# EAGLE schematic aqm_sch (EAGLE 9.6.2)
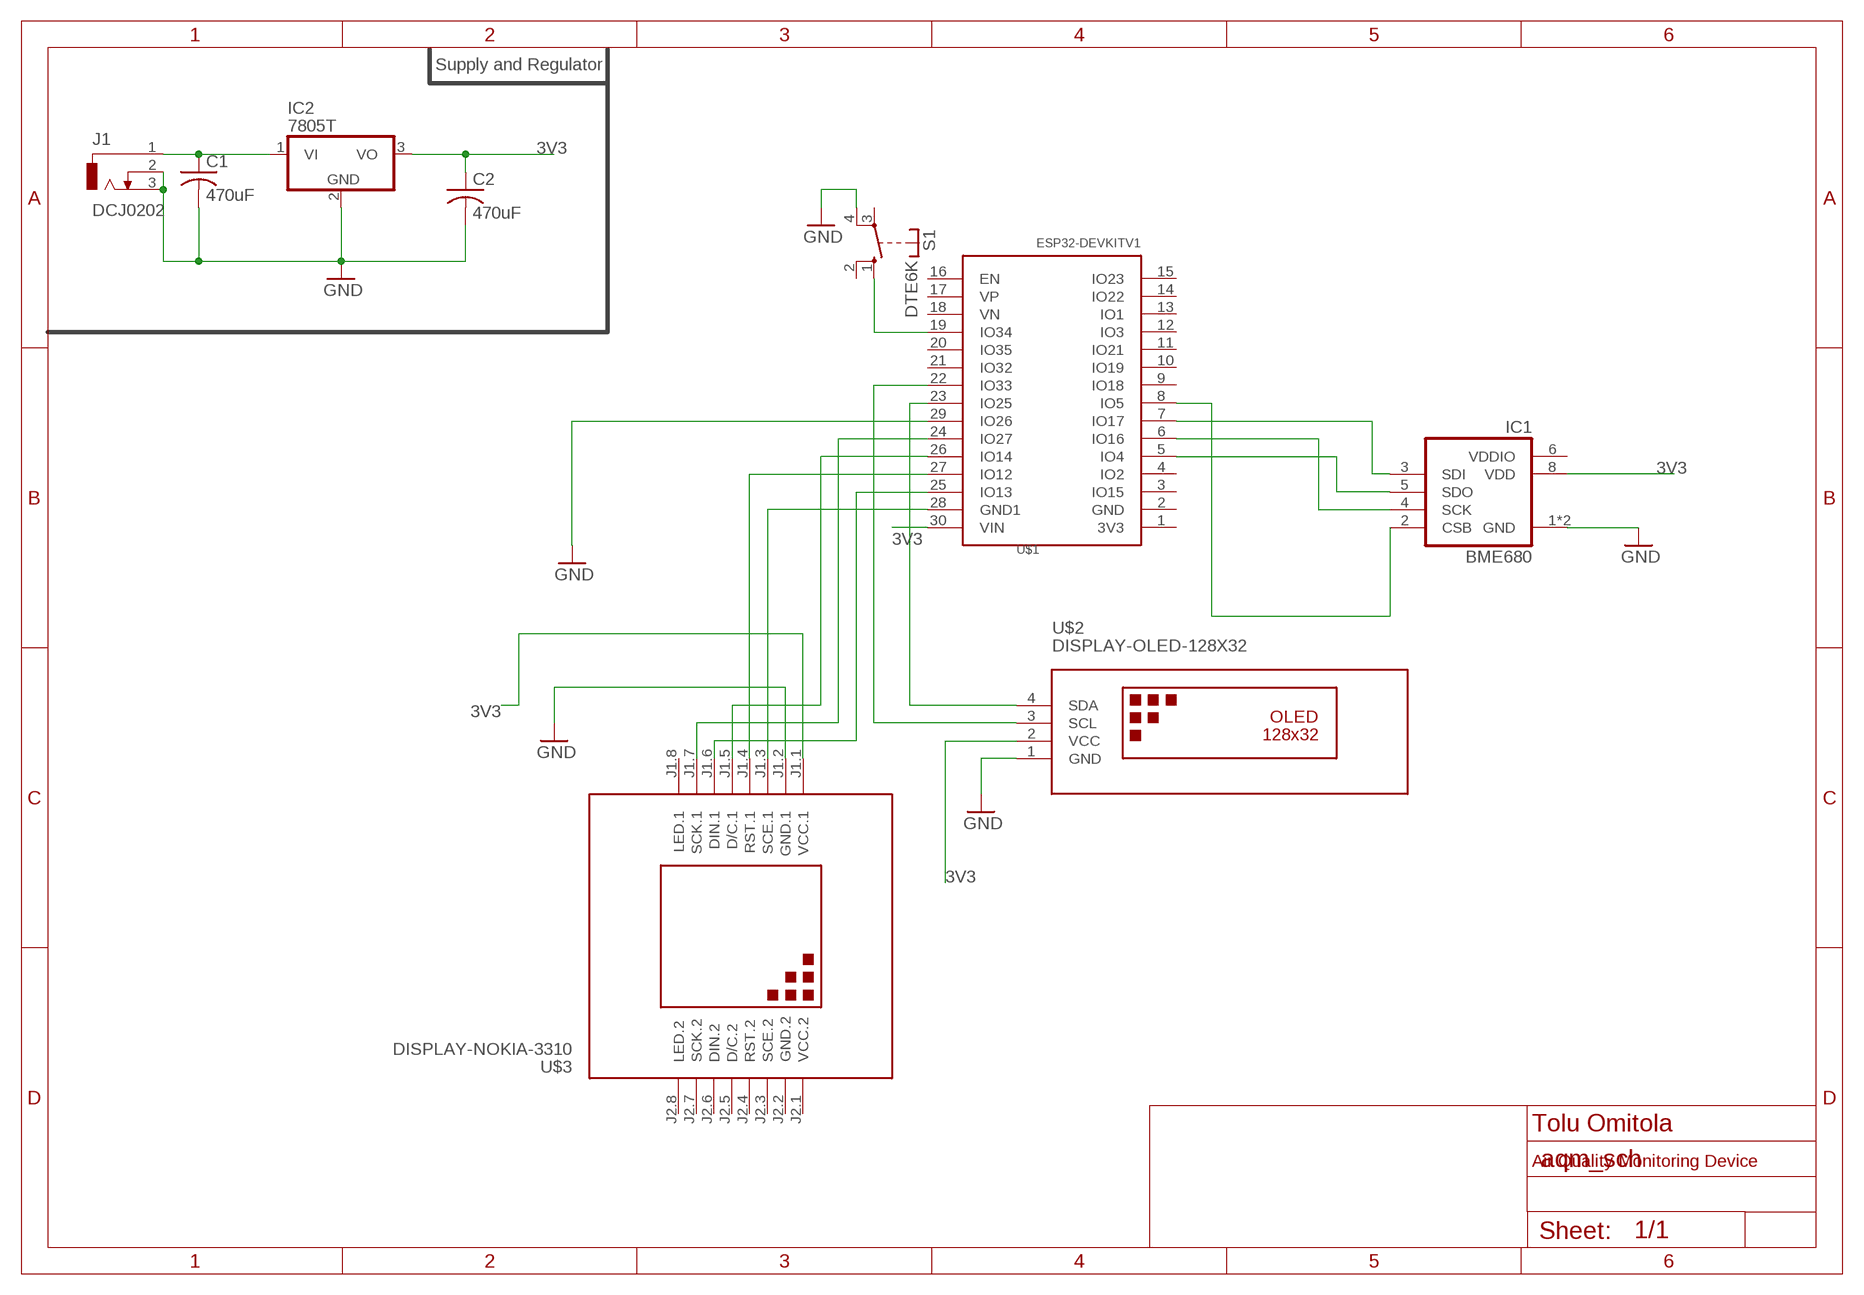
[diagram p0: schematic, sheet 1]

## Parts
C1  470uF  C-US075-052X106  [C075-052X106]
C2  470uF  C-US075-052X106  [C075-052X106]
IC1  BME680  [BME680]
IC2  7805T  [TO220H]
J1  DCJ0202  [DCJ0202]
S1  DTE6K  [DTE6K]
U$1  ESP32DEVKITV1  [ESP32-DEVKITV1]
U$2  DISPLAY-OLED-128X32  [DISPLAY-OLED-128X32]
U$3  DISPLAY-NOKIA-3310  [DISPLAY-NOKIA-3310]

## Nets
3V3: C2.1 IC1.8(VDD) IC2.3(VO) U$1.30(VIN) U$2.2(VCC) U$3.J1.1(VCC.1)
GND: C1.2 C2.2 IC1.1(GND) IC1.7(GND) IC2.2(GND) J1.2 J1.3 S1.4(P) U$1.29(IO26) U$2.1(GND) U$3.J1.2(GND.1)
N$1: U$1.26(IO14) U$3.J1.5(D/C.1)
N$2: U$1.28(GND1) U$3.J1.3(SCE.1)
N$3: U$1.24(IO27) U$3.J1.7(SCK.1)
N$4: U$1.25(IO13) U$3.J1.6(DIN.1)
N$5: C1.1 IC2.1(VI) J1.1
N$6: U$1.23(IO25) U$2.4(SDA)
N$7: IC1.2(CSB) U$1.8(IO5)
N$9: U$1.22(IO33) U$2.3(SCL)
N$10: IC1.4(SCK) U$1.6(IO16)
N$11: IC1.5(SDO) U$1.5(IO4)
N$12: U$1.27(IO12) U$3.J1.4(RST.1)
N$13: IC1.3(SDI) U$1.7(IO17)
N$16: S1.1(S) U$1.19(IO34)
Unconnected: S1.2(S) S1.3(P) U$1.1(3V3) U$1.2(GND) U$1.3(IO15) U$1.4(IO2) U$1.9(IO18) U$1.10(IO19) U$1.11(IO21) U$1.12(IO3) U$1.13(IO1) U$1.14(IO22) U$1.15(IO23) U$1.16(EN) U$1.17(VP) U$1.18(VN) U$1.20(IO35) U$1.21(IO32) U$3.J1.8(LED.1) U$3.J2.3(SCE.2) U$3.J2.4(RST.2) U$3.J2.5(D/C.2) U$3.J2.6(DIN.2) U$3.J2.7(SCK.2) U$3.J2.8(LED.2)

## Notes on the sheet
- Supply and Regulator
- Tolu Omitola
- Air Quality Monitoring Device

## Power pins joined to a net without a drawn wire
GND.2: U$3.J2.2(GND.2)
VCC.2: U$3.J2.1(VCC.2)
VDDIO: IC1.6(VDDIO)

## Library data of the parts
C1 C2 = rcl:C-US: CAPACITOR, American symbol; SPICEPREFIX: C
IC1 = bosch-bme680:BME680: BME680 integrates for the first time individual high linearity and high accuracy sensors for gas, pressure, humidity and temperature. The library has been designed by Richard Magdycz <https://www.facebook.com/groups/eaglecadsoftUK>
IC2 = linear:78*: Positive VOLTAGE REGULATOR Source: http://cache.national.com/ds/LM/LM78L05.pdf http://www.fairchildsemi.com/ds/LM/LM7805.pdf
J1 = con-jack:DCJ0202: DC POWER JACK Source: DCJ0202.pdf; OC_FARNELL: unknown; OC_NEWARK: unknown
S1 = switch-misc:DT: ITT SWITCH
U$1 = ESP32-DEVKITV1:ESP32DEVKITV1
U$2 = diy-modules:DISPLAY-OLED-128X32: 128x32 Dot Matrix OLED Module with I2C interface based on SSD1306 chip More details available here: http://www.tinyosshop.com/index.php?route=product/product&product_id=953 Schematic available here: http://www.tinyosshop.com/datasheet/OLED%2012832.pdf SSD1306 datasheet: https://cdn-shop.adafruit.com/datasheets/SSD1306.pdf Click here to find device on ebay.com <http://www.ebay.com/sch/oled+display+128x32+i2c>
U$3 = diy-modules:DISPLAY-NOKIA-3310: 84x48 Dot Matrix LCD Module based on Nokia 3310 display More details available here: https://arduinoandsoftware.wordpress.com/2012/12/30/nokia-33105110-3-3v-display-with-5v-arduino/